# EAGLE schematic SmartCart1 (EAGLE 9.3.0)
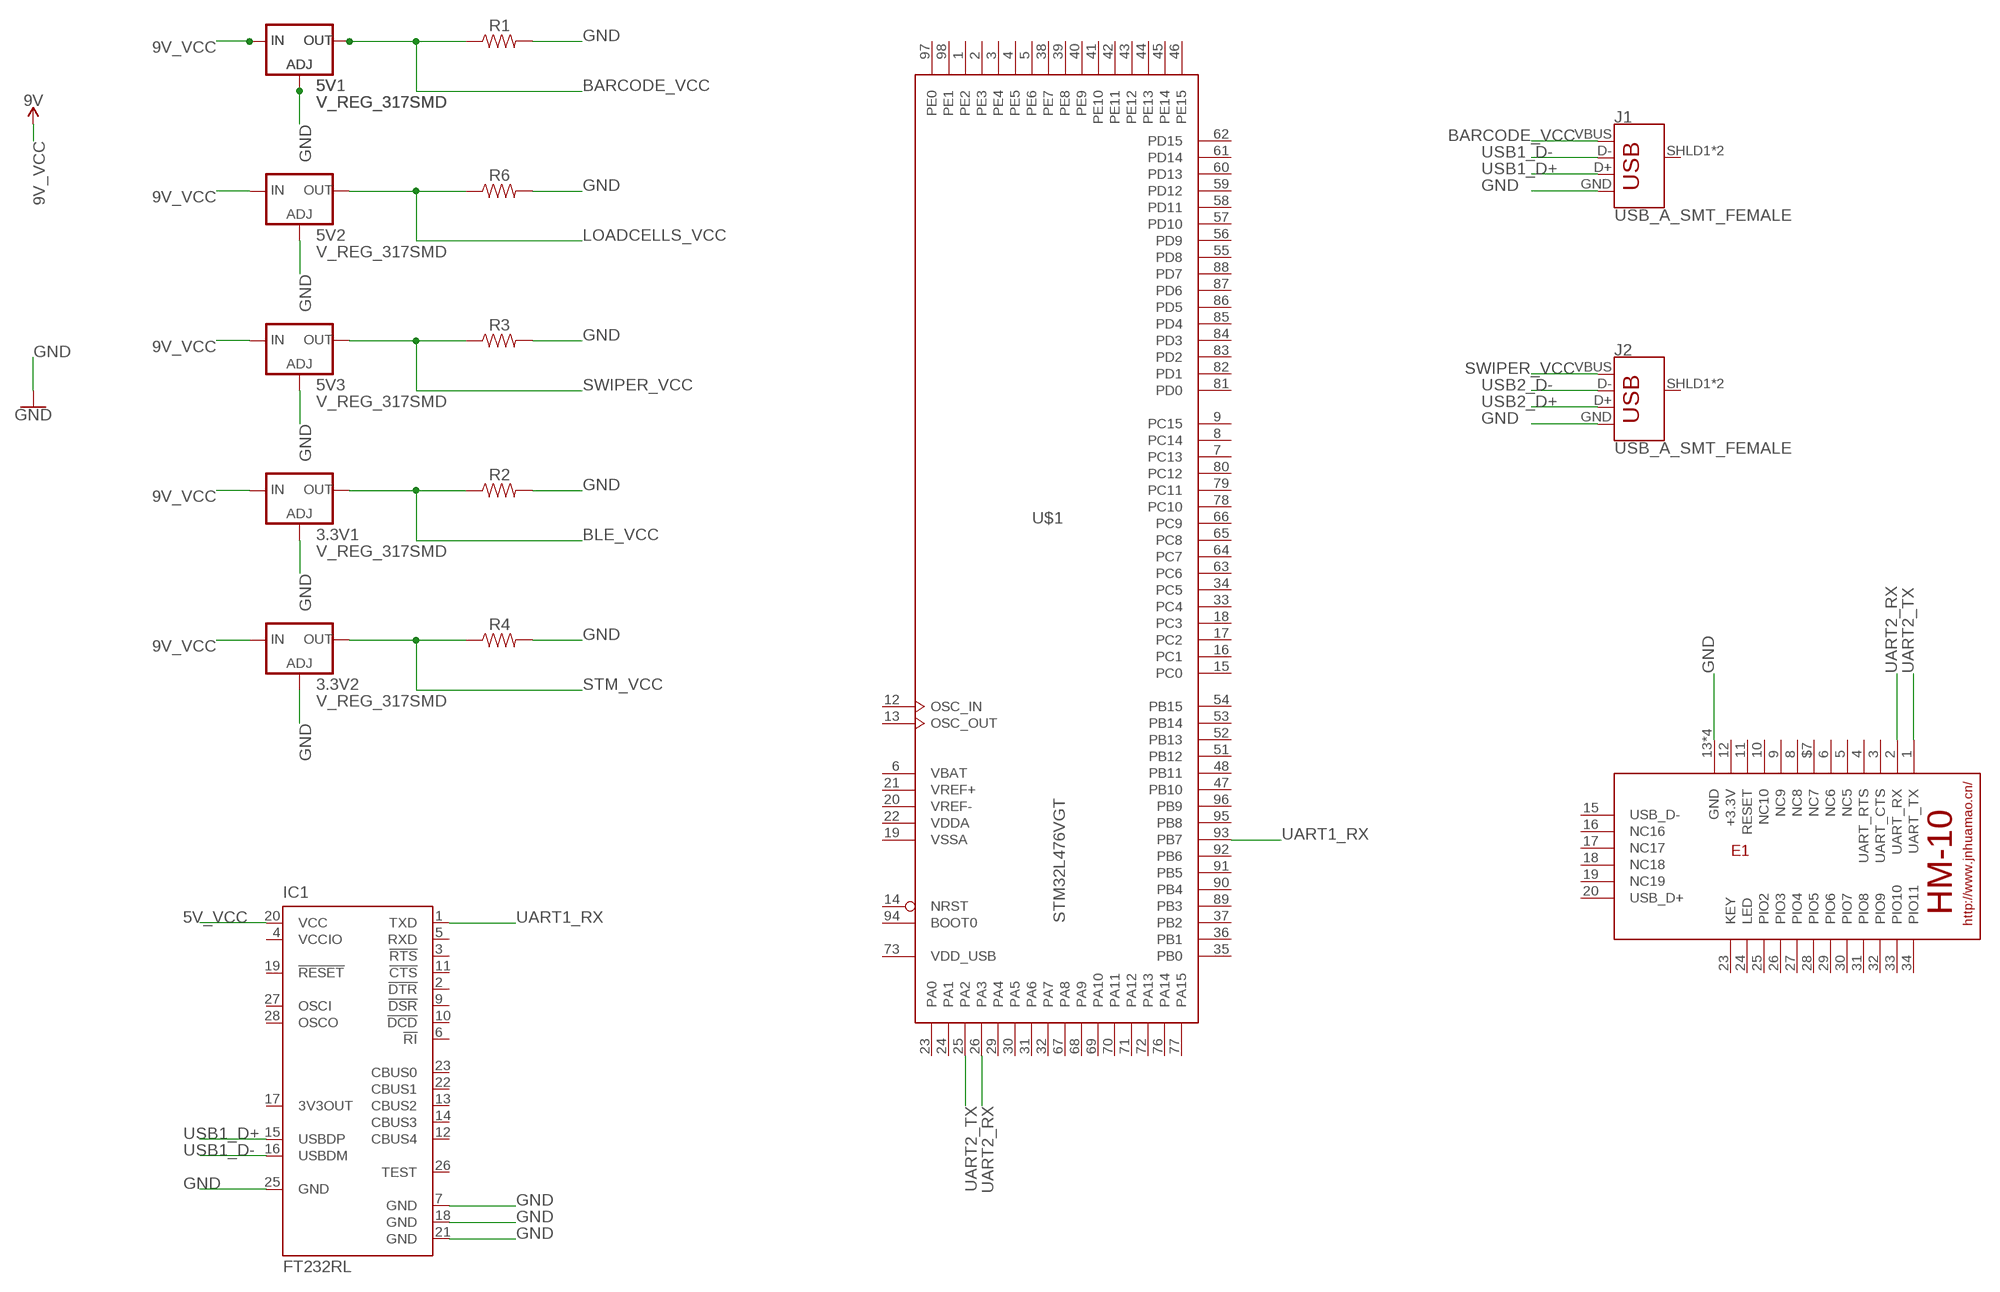
[diagram p0: schematic, sheet 1]

## Parts
3.3V1  V_REG_317SMD  [SOT223]
3.3V2  V_REG_317SMD  [SOT223]
5V  V_REG_317SMD  [SOT223]
5V1  V_REG_317SMD  [SOT223]
5V2  V_REG_317SMD  [SOT223]
5V3  V_REG_317SMD  [SOT223]
E1  HM-10-BOARD  [26.9X13X2.2_BOARD]
IC1  FT232RL  [SSOP28]
J1  USB_A_SMT_FEMALE  [USB-A-S-SILK-FEMALE]
J2  USB_A_SMT_FEMALE  [USB-A-S-SILK-FEMALE]
R1  RESISTOR0805  [0805]
R2  RESISTOR0805  [0805]
R3  RESISTOR0805  [0805]
R4  RESISTOR0805  [0805]
R6  RESISTOR0805  [0805]
U$1  STM32L476VGT  [LQFP100]

## Nets
5V_VCC: IC1.20(VCC)
9V_VCC: 3.3V1.3(IN) 3.3V2.3(IN) 5V1.3(IN) 5V2.3(IN) 5V3.3(IN) 5V.3(IN) ; supply symbol labelled 9V
BARCODE_VCC: 5V1.2(OUT) 5V.2(OUT) J1.VBUS R1.1
BLE_VCC: 3.3V1.2(OUT) R2.1
GND: 3.3V1.1(ADJ) 3.3V2.1(ADJ) 5V1.1(ADJ) 5V2.1(ADJ) 5V3.1(ADJ) 5V.1(ADJ) E1.6(NC6) E1.13(GND) E1.14(GND) E1.21(GND) E1.22(GND) IC1.7(GND) IC1.18(GND) IC1.21(GND) IC1.25(GND) J1.GND J2.GND R1.2 R2.2 R3.2 R4.2 R6.2
LOADCELLS_VCC: 5V2.2(OUT) R6.1
STM_VCC: 3.3V2.2(OUT) R4.1
SWIPER_VCC: 5V3.2(OUT) E1.9(NC9) J2.VBUS R3.1
UART1_RX: IC1.1(TXD) U$1.93(PB7)
UART2_RX: E1.2(UART_RX) U$1.26(PA3)
UART2_TX: E1.1(UART_TX) U$1.25(PA2)
USB1_D+: IC1.15(USBDP) J1.D+
USB1_D-: IC1.16(USBDM) J1.D-
USB2_D+: E1.$7(NC7) J2.D+
USB2_D-: E1.8(NC8) J2.D-
Unconnected: E1.3(UART_CTS) E1.4(UART_RTS) E1.5(NC5) E1.10(NC10) E1.11(RESET) E1.12(+3.3V) E1.15(USB_D-) E1.16(NC16) E1.17(NC17) E1.18(NC18) E1.19(NC19) E1.20(USB_D+) E1.23(KEY) E1.24(LED) E1.25(PIO2) E1.26(PIO3) E1.27(PIO4) E1.28(PIO5) E1.29(PIO6) E1.30(PIO7) E1.31(PIO8) E1.32(PIO9) E1.33(PIO10) E1.34(PIO11) IC1.2(!DTR) IC1.3(!RTS) IC1.5(RXD) IC1.6(!RI) IC1.9(!DSR) IC1.10(!DCD) IC1.11(!CTS) IC1.12(CBUS4) IC1.13(CBUS2) IC1.14(CBUS3) IC1.17(3V3OUT) IC1.19(!RESET) IC1.22(CBUS1) IC1.23(CBUS0) IC1.26(TEST) IC1.27(OSCI) IC1.28(OSCO) J1.SHLD1(SHIELD) J1.SHLD2(SHIELD) J2.SHLD1(SHIELD) J2.SHLD2(SHIELD) U$1.1(PE2) U$1.2(PE3) U$1.3(PE4) U$1.4(PE5) U$1.5(PE6) U$1.7(PC13) U$1.8(PC14) U$1.9(PC15) U$1.12(OSC_IN) U$1.13(OSC_OUT) U$1.14(NRST) U$1.15(PC0) U$1.16(PC1) U$1.17(PC2) U$1.18(PC3) U$1.23(PA0) U$1.24(PA1) U$1.29(PA4) U$1.30(PA5) U$1.31(PA6) U$1.32(PA7) U$1.33(PC4) U$1.34(PC5) U$1.35(PB0) U$1.36(PB1) U$1.37(PB2) U$1.38(PE7) U$1.39(PE8) U$1.40(PE9) U$1.41(PE10) U$1.42(PE11) U$1.43(PE12) U$1.44(PE13) U$1.45(PE14) U$1.46(PE15) U$1.47(PB10) U$1.48(PB11) U$1.51(PB12) U$1.52(PB13) U$1.53(PB14) U$1.54(PB15) U$1.55(PD8) U$1.56(PD9) U$1.57(PD10) U$1.58(PD11) U$1.59(PD12) U$1.60(PD13) U$1.61(PD14) U$1.62(PD15) U$1.63(PC6) U$1.64(PC7) U$1.65(PC8) U$1.66(PC9) U$1.67(PA8) U$1.68(PA9) U$1.69(PA10) U$1.70(PA11) U$1.71(PA12) U$1.72(PA13) U$1.76(PA14) U$1.77(PA15) U$1.78(PC10) U$1.79(PC11) U$1.80(PC12) U$1.81(PD0) U$1.82(PD1) U$1.83(PD2) U$1.84(PD3) U$1.85(PD4) U$1.86(PD5) U$1.87(PD6) U$1.88(PD7) U$1.89(PB3) U$1.90(PB4) U$1.91(PB5) U$1.92(PB6) U$1.94(BOOT0) U$1.95(PB8) U$1.96(PB9) U$1.97(PE0) U$1.98(PE1)

## Power pins joined to a net without a drawn wire
VBAT: U$1.6(VBAT)
VCCIO: IC1.4(VCCIO)
VDD: U$1.11(VDD) U$1.28(VDD) U$1.50(VDD) U$1.75(VDD) U$1.100(VDD)
VDD_USB: U$1.73(VDD_USB)
VDDA: U$1.22(VDDA)
VREF+: U$1.21(VREF+)
VREF-: U$1.20(VREF-)
VSS: U$1.10(VSS) U$1.27(VSS) U$1.49(VSS) U$1.74(VSS) U$1.99(VSS)
VSSA: U$1.19(VSSA)

## Library data of the parts
3.3V1 3.3V2 5V 5V1-5V3 = SparkFun-IC-Power:V_REG_317: Voltage Regulator Standard LM317 adjustable voltage regulator. AOI (Adjust Output Input). Google 'LM317 Calculator' for easy to use app to get the two resistor values needed. 240/720 for 5V output. 240/390 for 3.3V output. Spark Fun Electronics SKU : COM-00527
E1 = HM10:HM-10: HM Bluetooth module use TI CC2540 or CC2541, Master and slave roles in one, transmission version and remote control version and PIO state acquisition functions in one, Support the AT command modify module parameters, Convenient and flexible.
IC1 = ftdichip:FT232R: Source: http://www.ftdichip.com/Documents/DataSheets/DS_FT232R_v104.pdf; MPN: FT232RL; OC_FARNELL: 1146032; OC_NEWARK: 91K9918
J1 J2 = SparkFun-Connectors:USB_A: USB-A Connector Male and female variants, as well as PTH and SMT variants SparkFun Products: SparkFun XBee Explorer Dongle <https://www.sparkfun.com/products/11697> PTH Male SparkFun MicroView-USB Programmer <https://www.sparkfun.com/products/12924> SMT Male SparkFun USB Type A Female Breakout <https://www.sparkfun.com/products/12700> SMT Female; PROD_ID: CONN-09520; SF_ID: PRT-09011
R1-R4 R6 = SparkFun-Resistors:RESISTOR: Generic Resistor Package
U$1 = stm32Micro:STM32L476V*T: ARM 32-bit Cortex™-M4 CPU 80 MHz maximum frequency 256..1024 Kbytes of Flash memory 128 kbytes of SRAM 82 GPIOs 1.71 to 3.6 V application supply